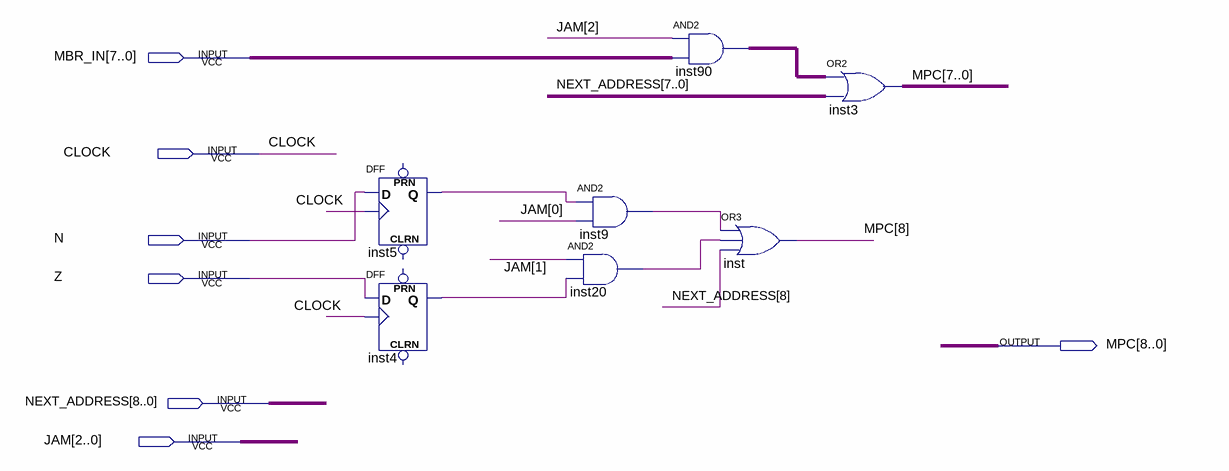
[diagram p0: schematic sheet]
// Quartus schematic MPC_GENERATOR.bdf as structural Verilog: 7 symbols, 7 pins
module MPC_GENERATOR (
  input  [7:0] MBR_IN,
  input  CLOCK,
  input  N,
  input  Z,
  input  [8:0] NEXT_ADDRESS,
  input  [2:0] JAM,
  output [8:0] MPC
);

  wire inst4_q, inst5_q, inst9_out, inst20_out;
  wire [7:0] inst90_out;

  DFF inst5 (.CLK(CLOCK), .D(N), .Q(inst5_q));  // open: CLRN, PRN
  DFF inst4 (.CLK(CLOCK), .D(Z), .Q(inst4_q));  // open: CLRN, PRN
  and inst20 (inst20_out, JAM[1], inst4_q);
  and inst9 (inst9_out, inst5_q, JAM[0]);
  assign inst90_out = {8{JAM[2]}} & MBR_IN;  // AND2 inst90, 8 bits wide
  or inst (MPC[8], inst9_out, inst20_out, NEXT_ADDRESS[8]);
  assign MPC[7:0] = inst90_out | NEXT_ADDRESS[7:0];  // OR2 inst3, 8 bits wide
endmodule
